# EAGLE design IoT-Mailbox-Guard (EAGLE 7.2.0)
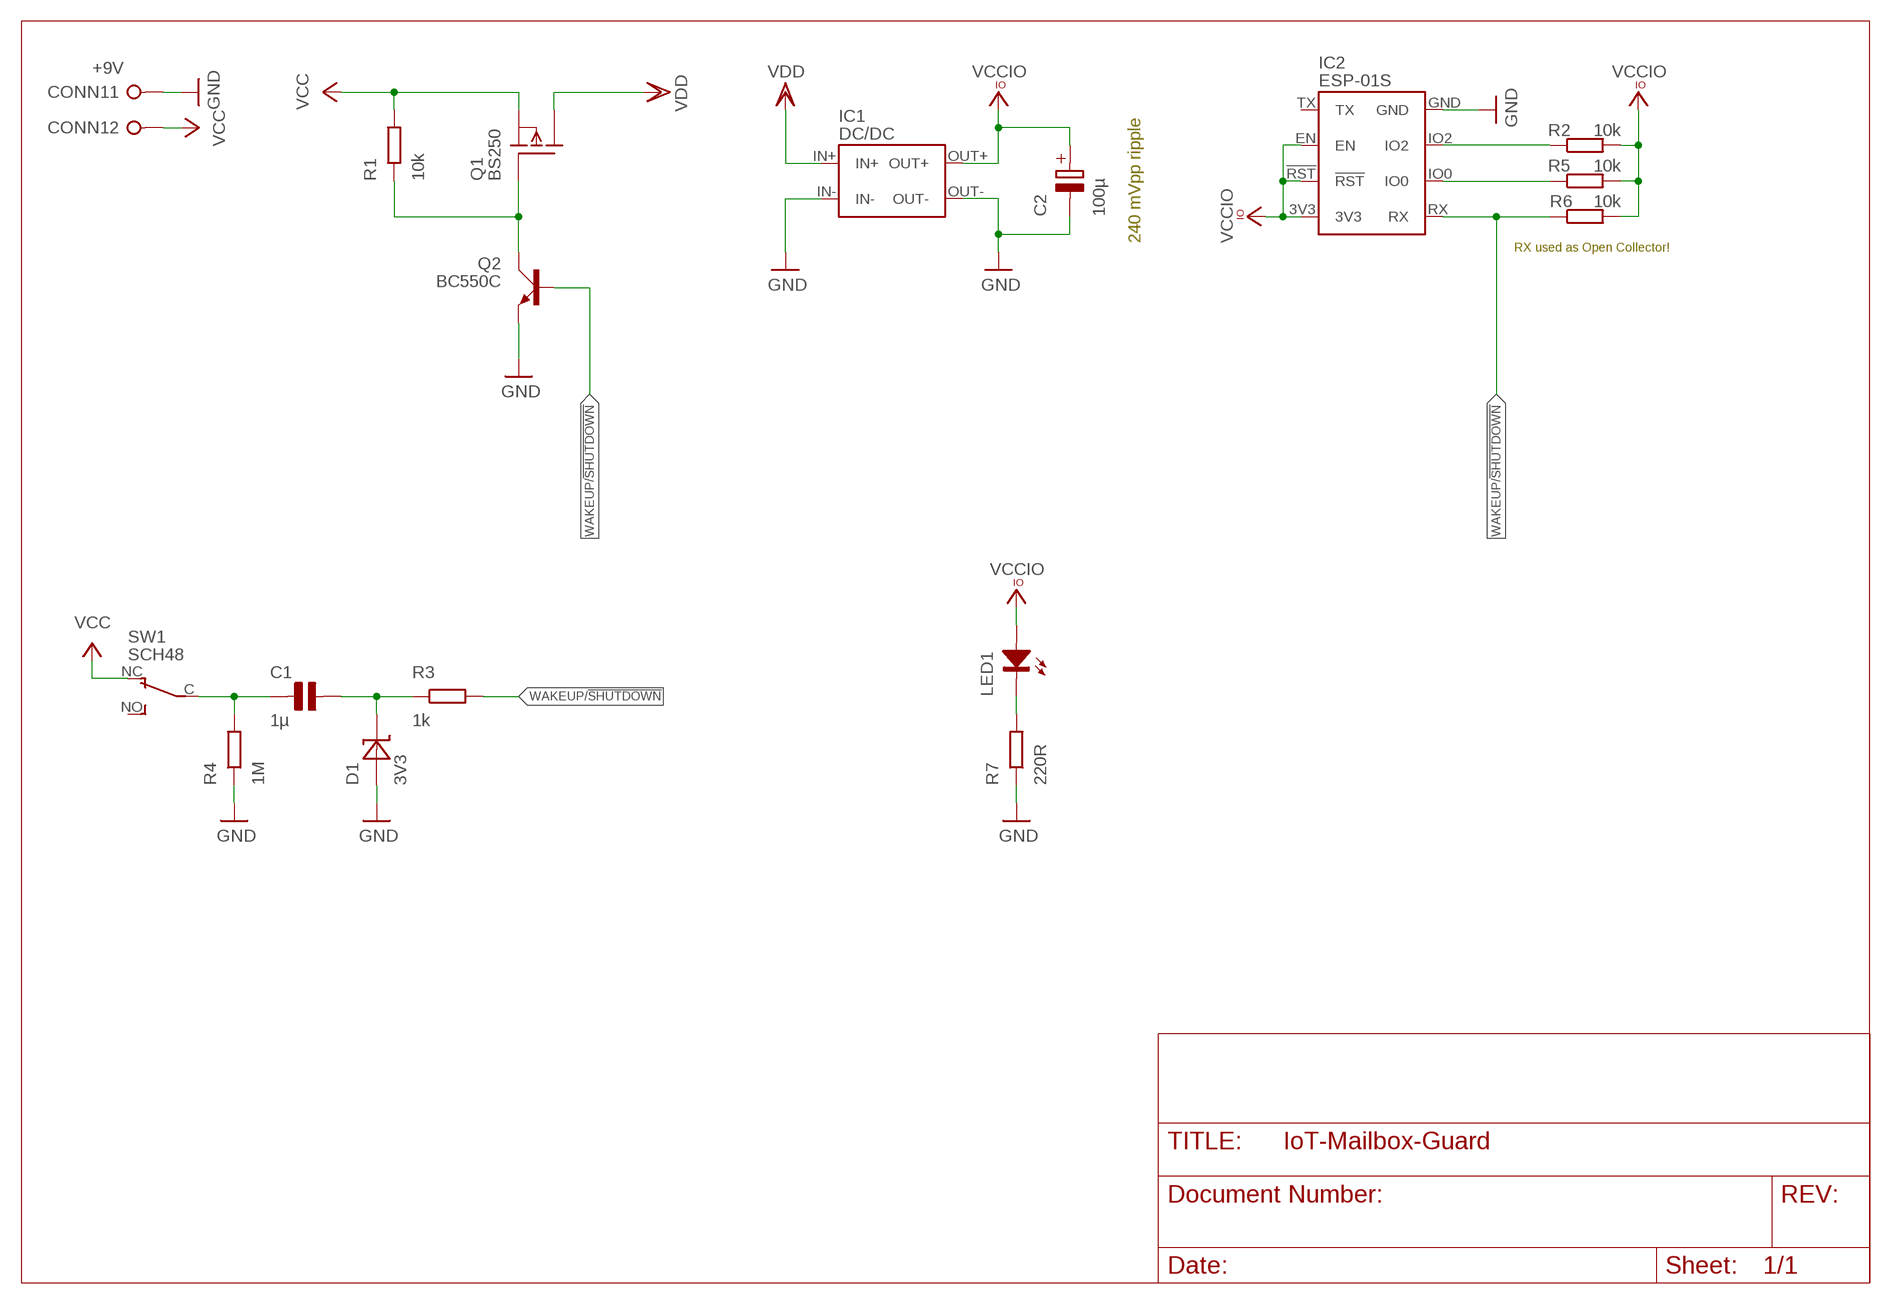
[diagram p0: schematic, sheet 1]

## Parts
C1  1µ  C-5,08  [GENERIC-5.08]
C2  100µ  ELKO-2.54-6MM  [ELKO-2.54-6MM]
CONN1  +9V  WAGO-2  [WAGO-2]
D1  3V3  DIODE-ZENER-7.62  [DIODE-7.62]
IC1  DC/DC  [DC/DC-MINI360-BUCK]
IC2  ESP-01S  [ESP-01S]
LED1  LED-3  [LED-3]
Q1  BS250  PMOSFET-TO-92  [TO-92]
Q2  BC550C  NPN-TO-92  [TO-92]
R1  10k  R-7,62  [GENERIC-7.62]
R2  10k  R-7,62  [GENERIC-7.62]
R3  1k  R-7,62  [GENERIC-7.62]
R4  1M  R-7,62  [GENERIC-7.62]
R5  10k  R-7,62  [GENERIC-7.62]
R6  10k  R-7,62  [GENERIC-7.62]
R7  220R  R-7,62  [GENERIC-7.62]
SW1  SCH48  MICROSWITCH-SCH48  [MICROSWITCH-SCH48]

## Nets
GND: C2.- CONN1.1 D1.A IC1.IN- IC1.OUT- IC2.GND Q2.3(E) R4.1 R7.1
N$1: C1.1 R4.2 SW1.C(COM)
N$2: C1.2 D1.C R3.1
N$3: LED1.K(C) R7.2
N$4: IC2.IO2 R2.1
N$5: IC2.IO0 R5.1
SHUTDOWN_PULSE: Q1.2(G) Q2.1(C) R1.1
VCC: CONN1.2 Q1.3(S) R1.2 SW1.NC
VCCIO: C2.+ IC1.OUT+ IC2.3V3 IC2.!RST IC2.EN LED1.A R2.2 R5.2 R6.2
VDD: IC1.IN+ Q1.1(D)
WAKEUP/!SHUTDOWN: IC2.RX Q2.2(B) R3.2 R6.1
Unconnected: IC2.TX SW1.NO

## Notes on the sheet
- 240 mVpp ripple
- RX used as Open Collector!

## Library data of the parts
C1 = AllPartsEasy-2020-03:C: Kondensator (Capacitor)
C2 = AllPartsEasy-2020-03:ELKO: Elektrolytkondensator (Electrolytic capacitor)
CONN1 = AllPartsEasy-2020-03:WAGO-2: Fahrstuhlklemme (Screw clamp), 2x
D1 = AllPartsEasy-2020-03:DIODE-ZENER: Zener-Diode
IC1 = AllPartsEasy-2020-03:DC/DC: DC/DC-Wandler (DC/DC converter) Mini360: 4,75 V … 23 V Input, 1 V … 17 V Output, 1,8 A
IC2 = AllPartsEasy-2020-03:ESP-01S: ESP-01S
LED1 = AllPartsEasy-2020-03:LED: LED
Q1 = AllPartsEasy-2020-03:PMOSFET: P-Channel-MOSFET
Q2 = AllPartsEasy-2020-03:NPN: NPN-Transistor
R1-R7 = AllPartsEasy-2020-03:R: Widerstand (Resistor)
SW1 = AllPartsEasy-2020-03:MICROSWITCH: Mikroschalter (Microswitch)

## Board
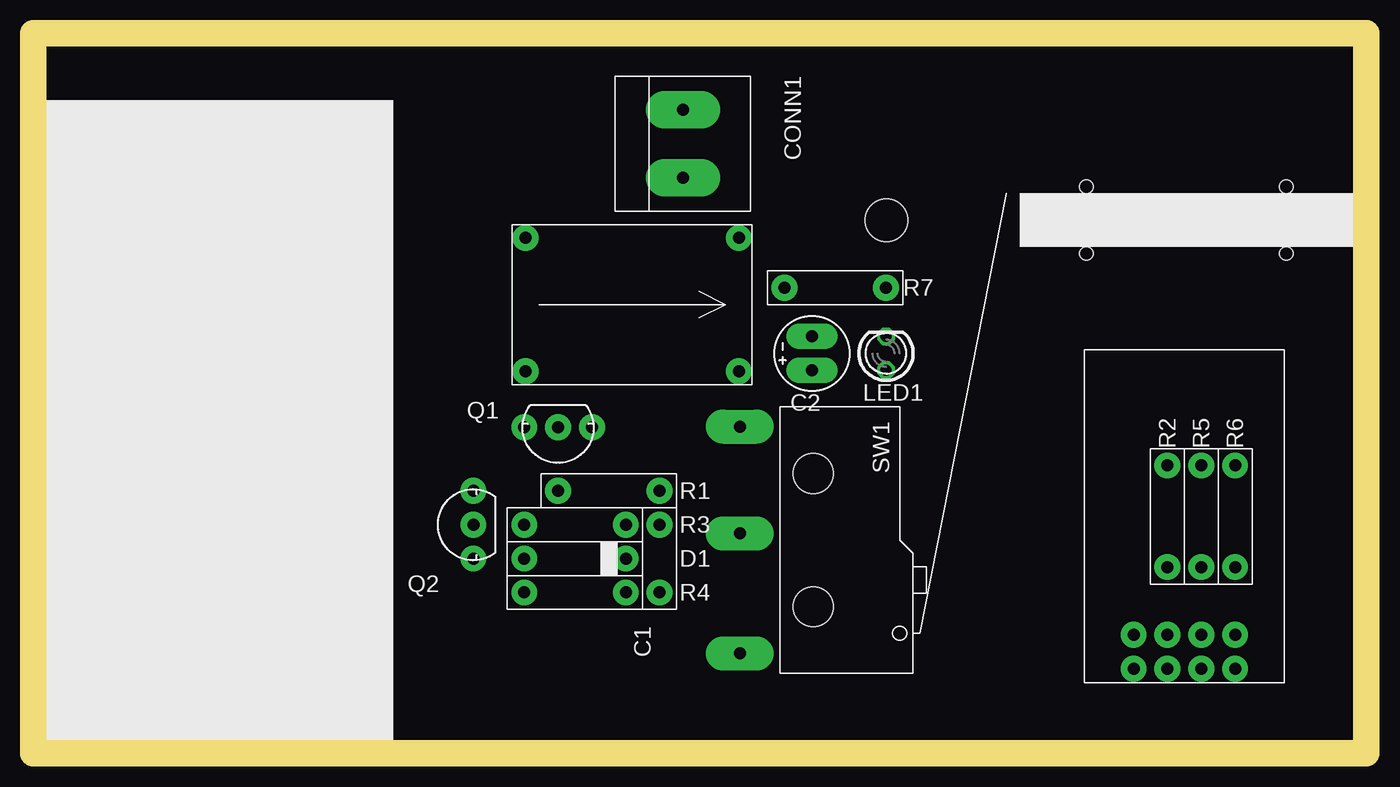
[diagram p1: board, top side]
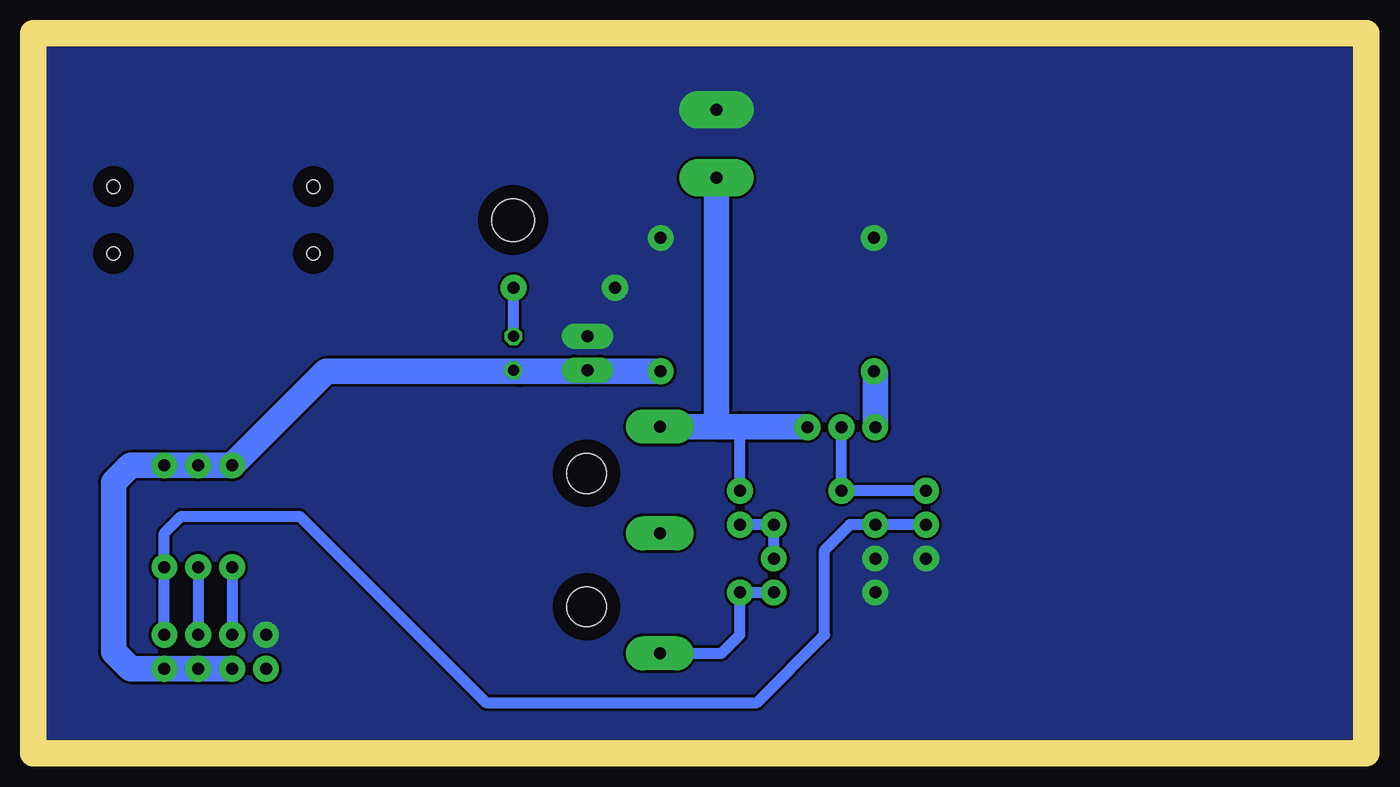
[diagram p2: board, bottom side, seen from below]

Size 100 x 54 mm. Coordinates in mm from the lower left corner, seen from the top.
Outline: 0,0 100,0 100,54 0,54 0,0
Copper layers (1*16): Top 0.035mm / dielectric 1.5mm / Bottom 0.035mm
Design rules "default": minimum track width 10mil, minimum drill 24mil, track to track 8mil, track to pad 8mil, pad to pad 8mil, via to via 8mil, smd to smd 8mil, copper to edge 40mil, drill to drill 8mil, minimum pad ring 10mil, minimum via ring 8mil, stop-mask expansion 4mil, vias tented up to drill 0mil, thermal gap 10mil
Holes 3.2 mm at 64,40
Holes 1 mm at 79,42.5 79,37.5 94,42.5 94,37.5
Milling: 4 lines

### Footprints (pad centres in the part's own frame; a part is rotated, then mirrored left to right if it is on the bottom)
GENERIC-5.08 = drill 0.9 pad 1.93: 1 -2.54,0; 2 2.54,0
ELKO-2.54-6MM = drill 0.9 pad 1.93 long: + -1.27,0; - 1.27,0
WAGO-2 = drill 0.9 pad 2.794 long: 1 -2.54,0; 2 2.54,0
DIODE-7.62 = drill 0.9 pad 1.93: A -3.81,0; C 3.81,0
DC/DC-MINI360-BUCK = drill 0.9 pad 1.93: IN+ -8,-5; IN- -8,5; OUT+ 8,-5; OUT- 8,5
ESP-01S = drill 0.9 pad 1.93: 3V3 -11.43,-3.81; !RST -11.43,-1.27; EN -11.43,1.27; GND -8.89,3.81; IO0 -8.89,-1.27; IO2 -8.89,1.27; RX -8.89,-3.81; TX -11.43,3.81
LED-3 = drill 0.813 octagon: A -1.27,0; K 1.27,0
TO-92 = drill 0.9 pad 1.93: 1 2.54,0; 2 0,0; 3 -2.54,0
GENERIC-7.62 = drill 0.9 pad 1.93: 1 -3.81,0; 2 3.81,0
MICROSWITCH-SCH48 = drill 0.9 pad 2.54 long: C 8.5,-3; NC -8.5,-3; NO -0.5,-3 | hole 3: -5,2.5; 5,2.5

### Placement (x,y rotation side)
C1  46.99,14.61 90 top
C2  58.42,30 90 top
CONN1  48.74,45.72 270 top
D1  40.64,14.61 0 top
IC1  44.93,33.66 0 top
IC2  86.36,17.78 90 top
LED1  63.98,30 90 top
Q1  39.37,24.45 180 top
Q2  33.02,17.14 90 top
R1  43.18,19.68 0 top
R2  85.09,17.78 90 top
R3  40.64,17.14 180 top
R4  40.64,12.06 0 top
R5  87.63,17.78 90 top
R6  90.17,17.78 90 top
R7  60.17,34.92 0 top
SW1  56,16 270 top

### Tracks (layer width: path | path; a pad name or v marks a point on that pad's centre or on a via)
GND
  pour Bottom (no thermals): 0,0 100,0 100,54 0,54
N$1
  Bottom 0.813: SW1.C 48.38,7.5 46.99,8.89 C1.1 R4.2
N$2
  Bottom 0.813: D1.C R3.1 C1.2
N$3
  Bottom 0.813: LED1.K R7.2
N$4
  Bottom 0.813: R2.1 IC2.IO2
N$5
  Bottom 0.813: R5.1 IC2.IO0
SHUTDOWN_PULSE
  Bottom 0.813: Q2.1 R1.1 Q1.2
VCC
  Bottom 0.813: R1.2 46.99,24.5
  Bottom 1.93: CONN1.2 48.74,24.5 | 48.74,24.5 SW1.NC | 48.74,24.5 46.99,24.5 41.96,24.5 Q1.3
VCCIO
  Bottom 0.406: C2.+ 58.42,28.66
  Bottom 0.813: LED1.A 63.5,28.73 63.5,28.66
  Bottom 1.93: IC2.EN IC2.!RST IC2.3V3 92.71,6.35 93.98,7.62 93.98,20.32 92.71,21.59 R6.2 R5.2 R2.2 78.03,28.66 63.5,28.66 58.42,28.66 IC1.OUT+
VDD
  Bottom 1.93: Q1.1 36.83,28.56 IC1.IN+
WAKEUP/!SHUTDOWN
  Bottom 0.813: IC2.RX R6.1 90.17,16.51 88.9,17.78 80.01,17.78 66.04,3.81 45.72,3.81 40.64,8.89 40.64,15.24 38.73,17.14 R3.2 Q2.2